# Altium project FV1Buddy.PrjPcb
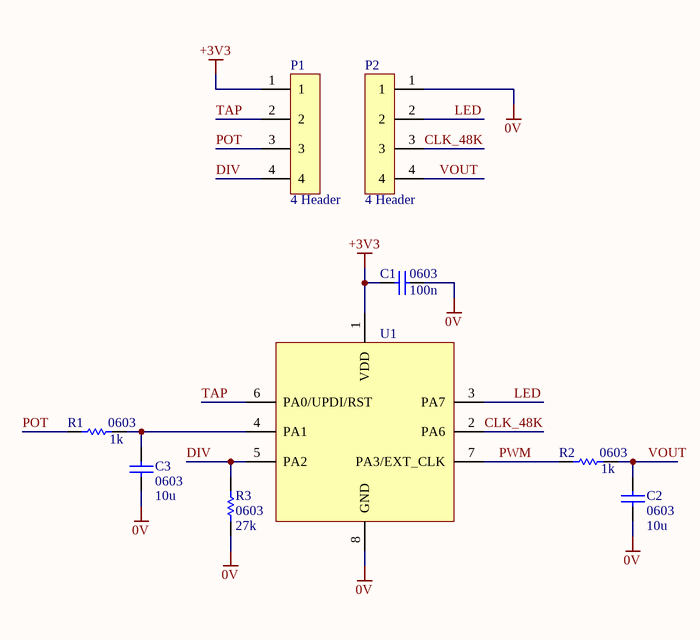
[diagram p0: FV1Buddy.SchDoc]
1 sheet, 9 parts. Net scope: global (net labels, ports and power ports of the same name join across sheets).
Board file: FV1Buddy.PcbDoc

## Sheet FV1Buddy.SchDoc
size A3; SheetNumber: 1; SheetTotal: 1

### Parts
C1  value 100n  Package: 0603  [CAPC1608X09N]  (hidden comment: C_NP_0603_Generic)
C2  value 10u  Package: 0603  [CAPC1608X09N]  (hidden comment: C_NP_0603_Generic)
C3  value 10u  Package: 0603  [CAPC1608X09N]  (hidden comment: C_NP_0603_Generic)
P1  4 Header  [H4]
P2  4 Header  [H4]
R1  value 1k  Package: 0603  [RESC1608X06N]  (hidden comment: R_0603_Generic)
R2  value 1k  Package: 0603  [RESC1608X06N]  (hidden comment: R_0603_Generic)
R3  value 27k  Package: 0603  [RESC1608X06N]  (hidden comment: R_0603_Generic)
U1  Attiny402  [SOIC127P600X175-8L]  (value not drawn)

### Nets
0V: C1.2 C2.1 C3.1 P2.1 R3.1 U1.8(GND)
+3V3: C1.1 P1.1 U1.1(VDD)
CLK_48K: P2.3 U1.2(PA6)
DIV: P1.4 R3.2 U1.5(PA2)
LED: P2.2 U1.3(PA7)
POT: P1.3 R1.1
PWM: R2.1 U1.7(PA3/EXT_CLK)
TAP: P1.2 U1.6(PA0/UPDI/RST)
VOUT: C2.2 P2.4 R2.2
NetC3_2: C3.2 R1.2 U1.4(PA1)

### Notes on the sheet
- Size:
- A3
- Variant:
- Revision:
- Drawn By:
- File:
- Date:
- Time:
- Sheet
- of
- AW Audio

### Library data of the parts
C1-C3 = C0-STD-0007-4: Generic 0603 Non Polarized Capacitor; Manufacturer: Generic; Category: Passive; Sub-Category: C
P1 P2 = H4
R1-R3 = C0-STD-0006-9: Generic 0603 Resistor; Manufacturer: Generic; Category: Passive; Sub-Category: R